# EAGLE design WhatCompressor (EAGLE 6.5.0)
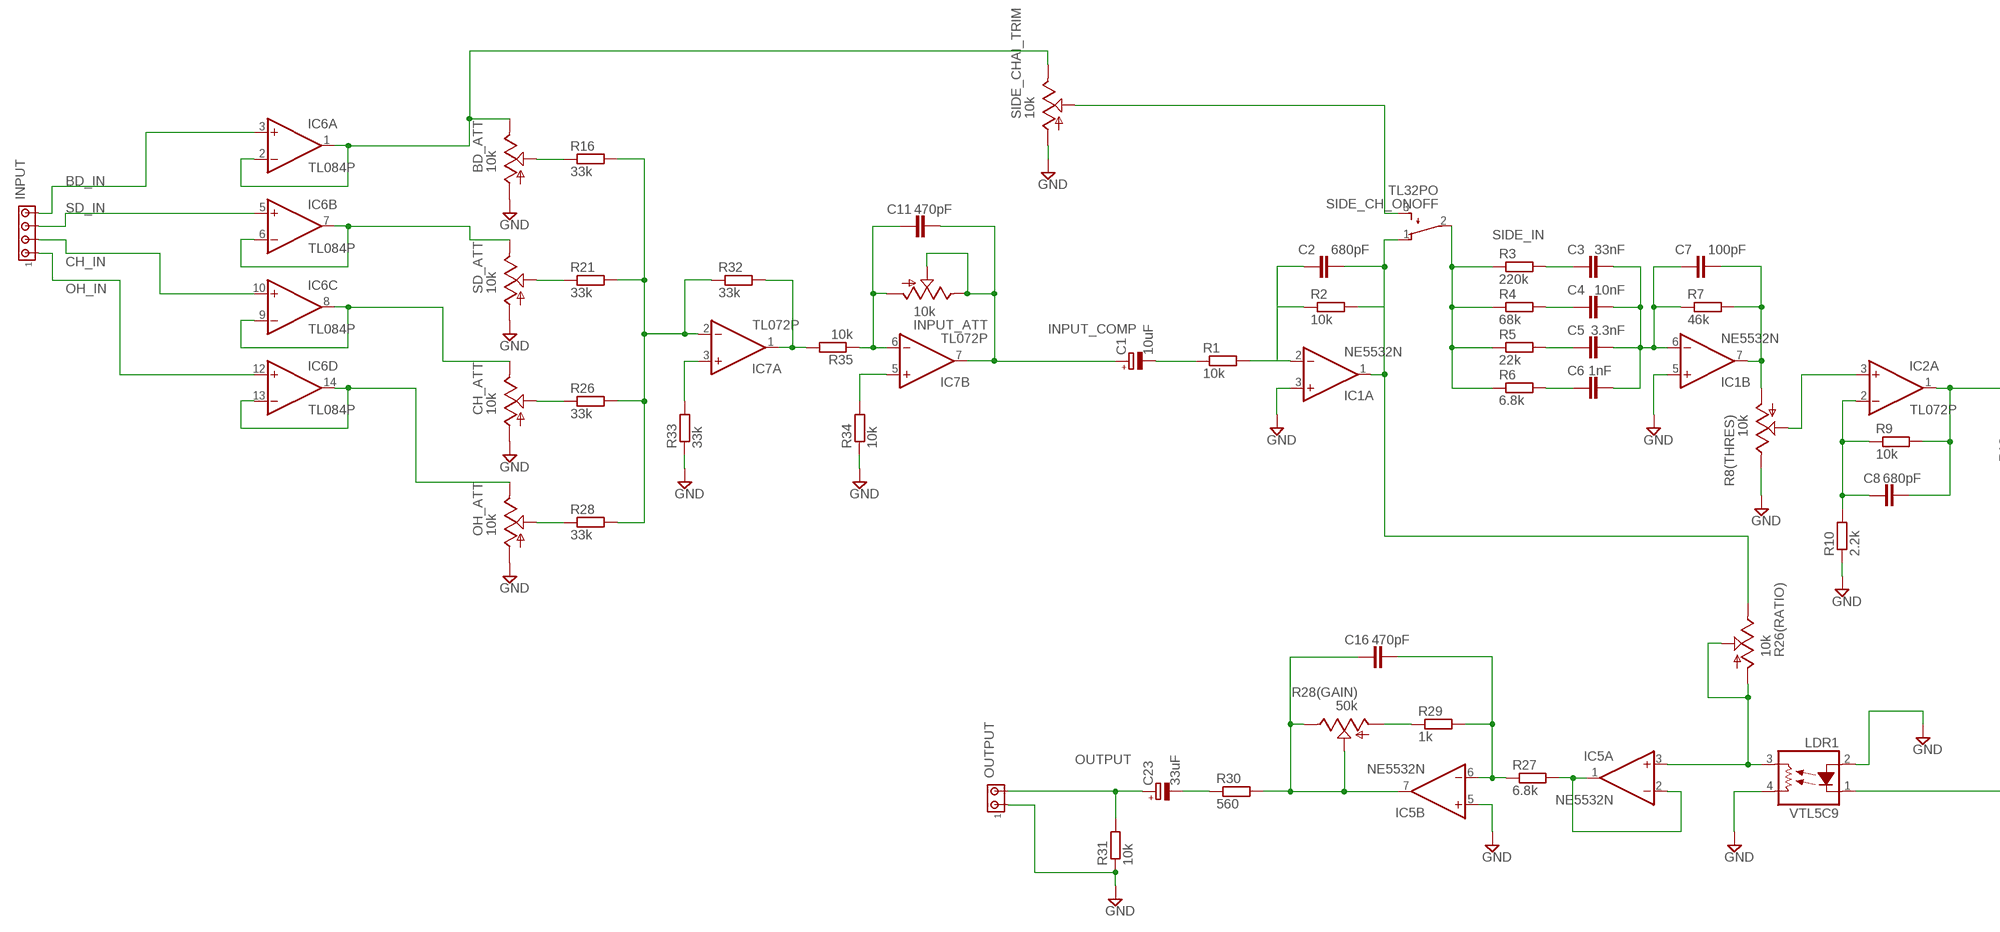
[diagram p0: schematic, sheet 1, part 1 of 2]
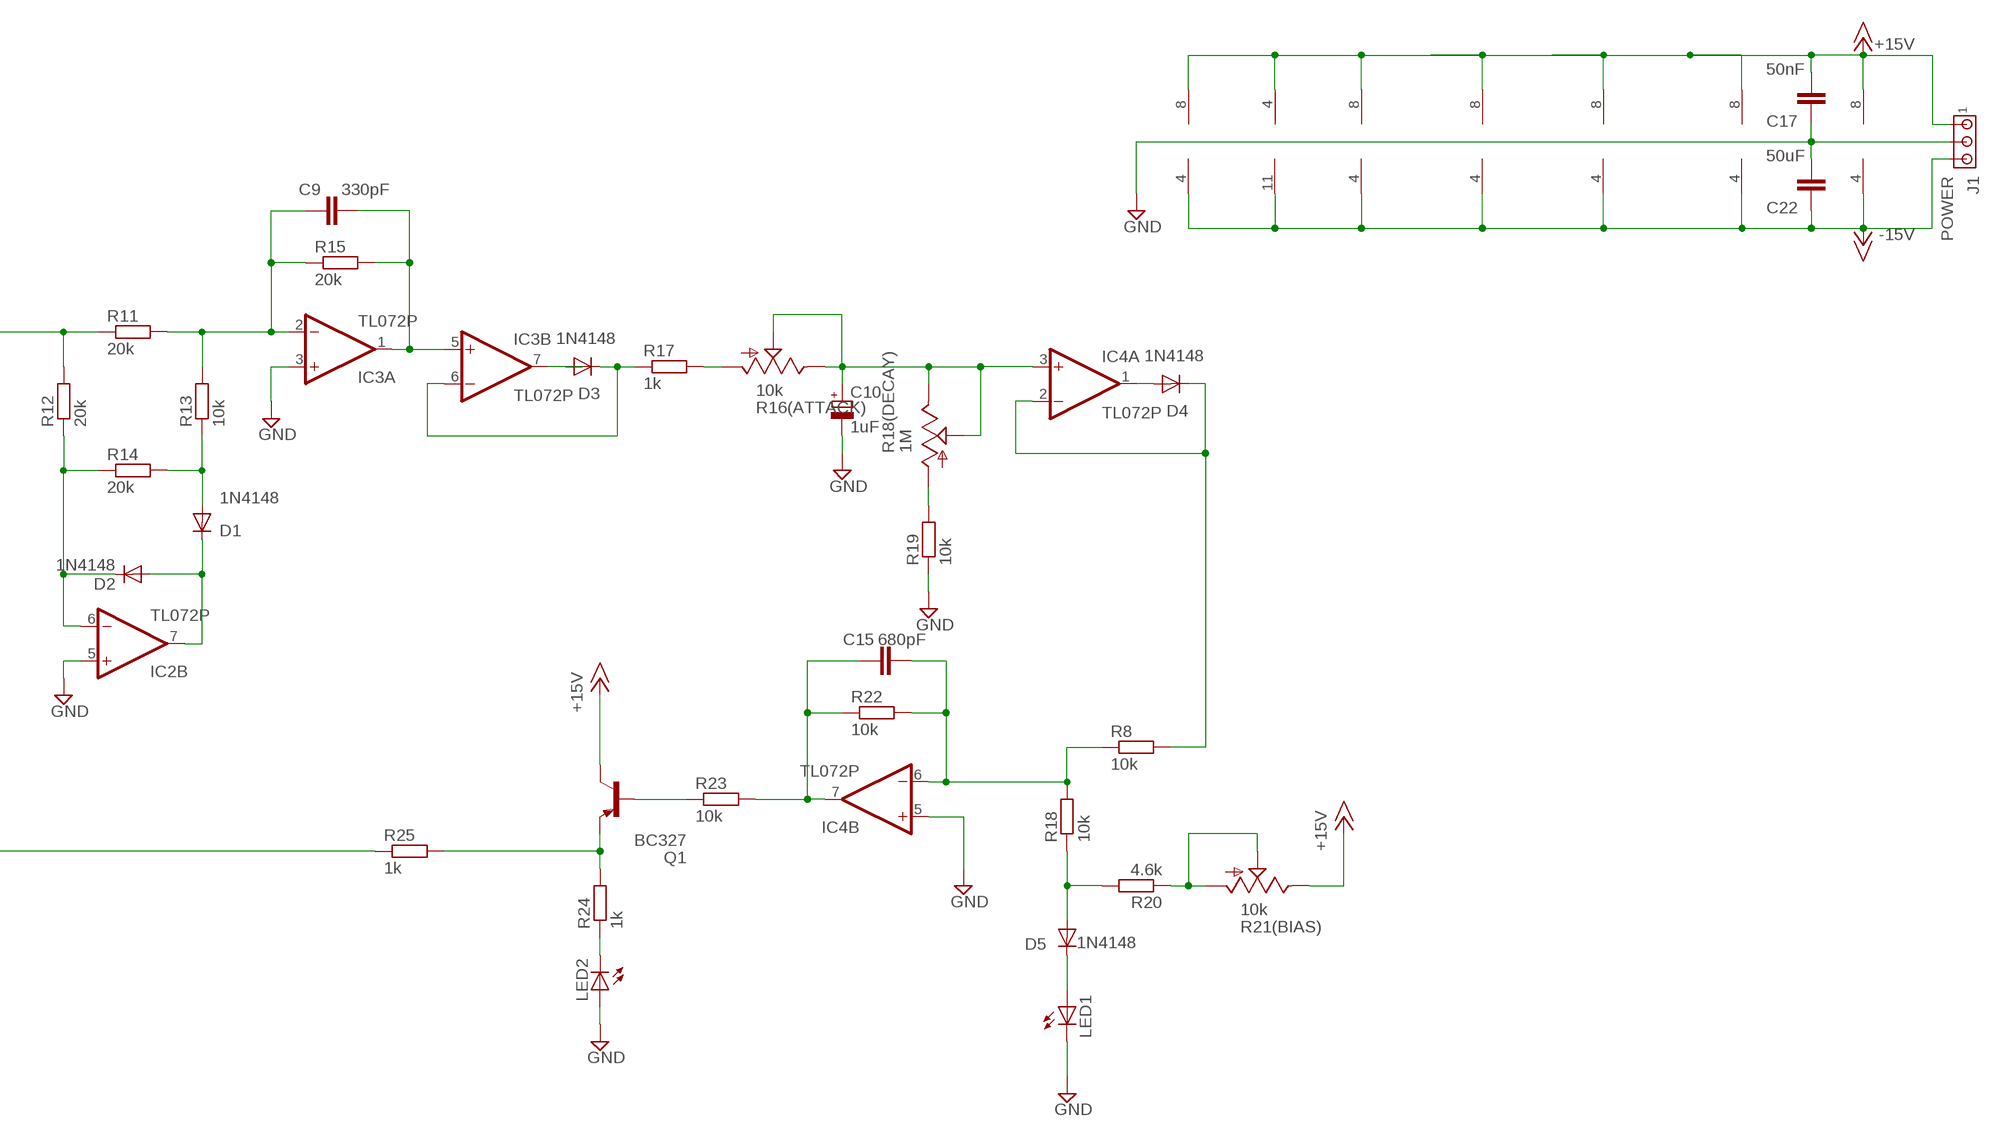
[diagram p1: schematic, sheet 1, part 2 of 2]

## Parts
BD_ATT  10k  TRIM_US-B64Y  [B64Y]
C1  10uF  CPOL-EUE2.5-5  [E2,5-5]
C2  680pF  C-EU050-024X044  [C050-024X044]
C3  33nF  C-EU050-024X044  [C050-024X044]
C4  10nF  C-EU050-024X044  [C050-024X044]
C5  3.3nF  C-EU050-024X044  [C050-024X044]
C6  1nF  C-EU050-024X044  [C050-024X044]
C7  100pF  C-EU050-024X044  [C050-024X044]
C8  680pF  C-EU050-024X044  [C050-024X044]
C9  330pF  C-EU050-024X044  [C050-024X044]
C10  1uF  CPOL-EUE2.5-5  [E2,5-5]
C11  470pF  C-EU050-024X044  [C050-024X044]
C15  680pF  C-EU050-024X044  [C050-024X044]
C16  470pF  C-EU050-024X044  [C050-024X044]
C17  50nF  C-EU050-024X044  [C050-024X044]
C22  50uF  C-EU050-024X044  [C050-024X044]
C23  33uF  CPOL-EUE2.5-5  [E2,5-5]
CH_ATT  10k  TRIM_US-B64Y  [B64Y]
D1  1N4148  1N4148DO35-7  [DO35-7]
D2  1N4148  1N4148DO35-7  [DO35-7]
D3  1N4148  1N4148DO35-7  [DO35-7]
D4  1N4148  1N4148DO35-7  [DO35-7]
D5  1N4148  1N4148DO35-7  [DO35-7]
IC1  NE5532N  [DIL08]
IC2  TL072P  [DIL08]
IC3  TL072P  [DIL08]
IC4  TL072P  [DIL08]
IC5  NE5532N  [DIL08]
IC6  TL084P  [DIL14]
IC7  TL072P  [DIL08]
INPUT  MTA04-100  [10X04MTA]
INPUT_ATT  10k  TRIM_US-B64Y  [B64Y]
J1  POWER  MTA03-100  [10X03MTA]
LDR1  VTL5C9  [VTL5C]
LED1  LED5MM  [LED5MM]
LED2  LED5MM  [LED5MM]
OH_ATT  10k  TRIM_US-B64Y  [B64Y]
OUTPUT  MTA02-100  [10X02MTA]
Q1  BC327  [TO92-EBC]
R1  10k  R-EU_0204/7  [0204/7]
R2  10k  R-EU_0204/7  [0204/7]
R3  220k  R-EU_0204/7  [0204/7]
R4  68k  R-EU_0204/7  [0204/7]
R5  22k  R-EU_0204/7  [0204/7]
R6  6.8k  R-EU_0204/7  [0204/7]
R7  46k  R-EU_0204/7  [0204/7]
R8  10k  R-EU_0204/7  [0204/7]
R8(THRES)  10k  TRIM_US-B64Y  [B64Y]
R9  10k  R-EU_0204/7  [0204/7]
R10  2.2k  R-EU_0204/7  [0204/7]
R11  20k  R-EU_0204/7  [0204/7]
R12  20k  R-EU_0204/7  [0204/7]
R13  10k  R-EU_0204/7  [0204/7]
R14  20k  R-EU_0204/7  [0204/7]
R15  20k  R-EU_0204/7  [0204/7]
R16  33k  R-EU_0204/7  [0204/7]
R16(ATTACK)  10k  TRIM_US-B64Y  [B64Y]
R17  1k  R-EU_0204/7  [0204/7]
R18  10k  R-EU_0204/7  [0204/7]
R18(DECAY)  1M  TRIM_US-B64Y  [B64Y]
R19  10k  R-EU_0204/7  [0204/7]
R20  4.6k  R-EU_0204/7  [0204/7]
R21  33k  R-EU_0204/7  [0204/7]
R21(BIAS)  10k  TRIM_US-B64Y  [B64Y]
R22  10k  R-EU_0204/7  [0204/7]
R23  10k  R-EU_0204/7  [0204/7]
R24  1k  R-EU_0204/7  [0204/7]
R25  1k  R-EU_0204/7  [0204/7]
R26  33k  R-EU_0204/7  [0204/7]
R26(RATIO)  10k  TRIM_US-B64Y  [B64Y]
R27  6.8k  R-EU_0204/7  [0204/7]
R28  33k  R-EU_0204/7  [0204/7]
R28(GAIN)  50k  TRIM_US-B64Y  [B64Y]
R29  1k  R-EU_0204/7  [0204/7]
R30  560  R-EU_0204/7  [0204/7]
R31  10k  R-EU_0204/7  [0204/7]
R32  33k  R-EU_0204/7  [0204/7]
R33  33k  R-EU_0204/7  [0204/7]
R34  10k  R-EU_0204/7  [0204/7]
R35  10k  R-EU_0204/7  [0204/7]
SD_ATT  10k  TRIM_US-B64Y  [B64Y]
SIDE_CH_ONOFF  TL32PO  [TL3XPO]
SIDE_CHAI_TRIM  10k  TRIM_US-B64Y  [B64Y]

## Nets
+15V: C17.2 IC1.8(P:V+) IC2.8(P:V+) IC3.8(P:V+) IC4.8(P:V+) IC5.8(P:V+) IC6.4(P:V+) IC7.8(P:V+) J1.1 Q1.C R21(BIAS).E
-15V: C22.1 IC1.4(P:V-) IC2.4(P:V-) IC3.4(P:V-) IC4.4(P:V-) IC5.4(P:V-) IC6.11(P:V-) IC7.4(P:V-) J1.3
BD_IN: IC6.3(A:+IN) INPUT.4
CH_IN: IC6.10(C:+IN) INPUT.2
GND: BD_ATT.A C10.- C17.1 C22.2 CH_ATT.A IC1.3(A:+IN) IC1.5(B:+IN) IC2.5(B:+IN) IC3.3(A:+IN) IC4.5(B:+IN) IC5.5(B:+IN) J1.2 LDR1.2(A) LDR1.4(L2) LED1.K(C) LED2.A OH_ATT.A OUTPUT.1 R8(THRES).E R10.1 R19.1 R31.1 R33.1 R34.1 SD_ATT.A SIDE_CHAI_TRIM.A
INPUT_COMP: C1.+ C11.2 IC7.7(B:OUT) INPUT_ATT.E INPUT_ATT.S
N$1: BD_ATT.E IC6.1(A:OUT) IC6.2(A:-IN) SIDE_CHAI_TRIM.E
N$2: C1.- R1.1
N$3: C2.1 IC1.2(A:-IN) R1.2 R2.1
N$4: IC6.6(B:-IN) IC6.7(B:OUT) SD_ATT.E
N$5: C3.1 R3.2
N$6: CH_ATT.E IC6.8(C:OUT) IC6.9(C:-IN)
N$7: C4.1 R4.2
N$8: C5.1 R5.2
N$9: C6.1 R6.2
N$10: C3.2 C4.2 C5.2 C6.2 C7.1 IC1.6(B:-IN) R7.1
N$11: C7.2 IC1.7(B:OUT) R7.2 R8(THRES).A
N$12: C8.1 IC2.2(A:-IN) R9.1 R10.2
N$13: C8.2 IC2.1(A:OUT) R9.2 R11.1 R12.2
N$14: IC2.3(A:+IN) R8(THRES).S
N$15: C9.1 IC3.2(A:-IN) R11.2 R13.2 R15.1
N$16: D2.C IC2.6(B:-IN) R12.1 R14.1
N$17: D1.A R13.1 R14.2
N$18: D1.C D2.A IC2.7(B:OUT)
N$19: C9.2 IC3.1(A:OUT) IC3.5(B:+IN) R15.2
N$20: D3.C IC3.6(B:-IN) R17.1
N$21: D3.A IC3.7(B:OUT)
N$22: D5.A R18.1 R20.2
N$23: R16(ATTACK).A R17.2
N$24: C10.+ IC4.3(A:+IN) R16(ATTACK).E R16(ATTACK).S R18(DECAY).E R18(DECAY).S
N$25: R18(DECAY).A R19.2
N$26: D4.C IC4.2(A:-IN) R8.2
N$27: D4.A IC4.1(A:OUT)
N$28: C15.2 IC4.6(B:-IN) R8.1 R18.2 R22.2
N$29: D5.C LED1.A
N$30: R20.1 R21(BIAS).A R21(BIAS).S
N$31: LED2.K(C) R24.1
N$32: C15.1 IC4.7(B:OUT) R22.1 R23.2
N$33: Q1.E R24.2 R25.2
N$34: Q1.B R23.1
N$35: LDR1.1(C) R25.1
N$36: IC5.3(A:+IN) LDR1.3(L1) R26(RATIO).A R26(RATIO).S
N$37: IC5.1(A:OUT) IC5.2(A:-IN) R27.2
N$38: C16.2 IC5.6(B:-IN) R27.1 R29.2
N$39: C23.- R30.1
N$40: R28(GAIN).A R29.1
N$41: C16.1 IC5.7(B:OUT) R28(GAIN).E R28(GAIN).S R30.2
N$43: SIDE_CH_ONOFF.3(S) SIDE_CHAI_TRIM.S
N$44: IC6.13(D:-IN) IC6.14(D:OUT) OH_ATT.E
N$46: BD_ATT.S R16.1
N$47: R21.1 SD_ATT.S
N$48: CH_ATT.S R26.1
N$49: OH_ATT.S R28.1
N$50: IC7.2(A:-IN) R16.2 R21.2 R26.2 R28.2 R32.1
N$51: IC7.3(A:+IN) R33.2
N$52: IC7.1(A:OUT) R32.2 R35.2
N$53: C11.1 IC7.6(B:-IN) INPUT_ATT.A R35.1
N$54: IC7.5(B:+IN) R34.2
OH_IN: IC6.12(D:+IN) INPUT.1
OUTPUT: C23.+ OUTPUT.2 R31.2
SD_IN: IC6.5(B:+IN) INPUT.3
SIDE_IN: R3.1 R4.1 R5.1 R6.1 SIDE_CH_ONOFF.2(P)
SIDE_OUT: C2.2 IC1.1(A:OUT) R2.2 R26(RATIO).E SIDE_CH_ONOFF.1(O)

## Library data of the parts
BD_ATT CH_ATT INPUT_ATT OH_ATT R8(THRES) R16(ATTACK) R18(DECAY) R21(BIAS) R26(RATIO) R28(GAIN) SD_ATT SIDE_CHAI_TRIM = pot:TRIM_US-: POTENTIOMETER; OC_FARNELL: unknown
C1 C23 = rcl:CPOL-EU: POLARIZED CAPACITOR, European symbol; MF: RUBYCON; MPN: 100PK10MEFC5X11; OC_FARNELL: 2346533
C2 C8 C15 = rcl:C-EU: CAPACITOR, European symbol; MF: VISHAY BC COMPONENTS; MPN: F681K33Y5RN6UK5R; OC_FARNELL: 1141791
C3 = rcl:C-EU: CAPACITOR, European symbol; MF: AVX; MPN: SR201C333KAR; OC_FARNELL: 1100438
C4 C17 C22 = rcl:C-EU: CAPACITOR, European symbol; MF: VISHAY; MPN: K103K15X7RF5TH5V; OC_FARNELL: 1902262
C5 C11 C16 = rcl:C-EU: CAPACITOR, European symbol; MF: MULTICOMP; MPN: MCBU7332K6; OC_FARNELL: 9411801
C6 = rcl:C-EU: CAPACITOR, European symbol; MF: VISHAY; MPN: K102K15X7RF5TH5V; OC_FARNELL: 1902259
C7 = rcl:C-EU: CAPACITOR, European symbol; MF: VISHAY BC COMPONENTS; MPN: F101K25Y5RP6UK5R; OC_FARNELL: 1141797
C9 = rcl:C-EU: CAPACITOR, European symbol; MF: VISHAY BC COMPONENTS; MPN: F331K29Y5RN6UK5R; OC_FARNELL: 1141787
C10 = rcl:CPOL-EU: POLARIZED CAPACITOR, European symbol; MF: PANASONIC; MPN: ECEA1HKS010; OC_FARNELL: 1902019
D1-D5 = diode:1N4148: DIODE high speed (Philips); MF: NXP; MPN: 1N4148; OC_FARNELL: 1081177
IC1 = linear:NE5532: AUDIO AMPLIFIER; MF: TEXAS INSTRUMENTS; MPN: NE5532P; OC_FARNELL: 1106092
IC2-IC4 = linear:TL072: OP AMP; MF: TEXAS INSTRUMENTS; MPN: TL072IP; OC_FARNELL: 1459704
IC5 = linear:NE5532: AUDIO AMPLIFIER
IC6 = linear:TL084: OP AMP
IC7 = linear:TL072: OP AMP
INPUT = con-amp:MTA04-100: AMP connector
J1 = con-amp:MTA03-100: AMP connector
LDR1 = optocoupler:VTL5C*: Low Cost Axial Vactrols Source: www.perkinelmer.com/opto ... vtl5c9_c10.pdf; MF: VACTEC PHOTO; MPN: VTL5C9; OC_FARNELL: 2067857; OC_NEWARK: 95F9033
LED1 LED2 = led:LED: LED OSRAM: - CHIPLED LG R971, LG N971, LY N971, LG Q971, LY Q971, LO R971, LY R971 LH N974, LH R974 LS Q976, LO Q976, LY Q976 LO Q996 - Hyper CHIPLED LW Q18S LB Q993, LB Q99A, LB R99A - SideLED LS A670, LO A670, LY A670, LG A670, LP A670 LB A673, LV A673, LT A673, LW A673 LH A674 LY A675 LS A676, LA A676, LO A676, LY A676, LW A676 LS A679, LY A679, LG A679 - Hyper Micro SIDELED® LS Y876, LA Y876, LO Y876, LY Y876 LT Y87S - SmartLED LW L88C, LW L88S LB L89C, LB L89S, LG L890 LS L89K, LO L89K, LY L89K LS L896, LA L896, LO L896, LY L896 - TOPLED LS T670, LO T670, LY T670, LG T670, LP T670 LSG T670, LSP T670, LSY T670, LOP T670, LYG T670 LG T671, LOG T671, LSG T671 LB T673, LV T673, LT T673, LW T673 LH T674 LS T676, LA T676, LO T676, LY T676, LB T676, LH T676, LSB T676, LW T676 LB T67C, LV T67C, LT T67C, LS T67K, LO T67K, LY T67K, LW E67C LS E67B, LA E67B, LO E67B, LY E67B, LB E67C, LV E67C, LT E67C LW T67C LS T679, LY T679, LG T679 LS T770, LO T770, LY T770, LG T770, LP T770 LB T773, LV T773, LT T773, LW T773 LH T774 LS E675, LA E675, LY E675, LS T675 LS T776, LA T776, LO T776, LY T776, LB T776 LHGB T686 LT T68C, LB T68C - Hyper Mini TOPLED® LB M676 - Mini TOPLED Santana® LG M470 LS M47K, LO M47K, LY M47K Source: http://www.osram.convergy.de LUXEON: - LUMILED® LXK2-PW12-R00, LXK2-PW12-S00, LXK2-PW14-U00, LXK2-PW14-V00 LXK2-PM12-R00, LXK2-PM12-S00, LXK2-PM14-U00 LXK2-PE12-Q00, LXK2-PE12-R00, LXK2-PE12-S00, LXK2-PE14-T00, LXK2-PE14-U00 LXK2-PB12-K00, LXK2-PB12-L00, LXK2-PB12-M00, LXK2-PB14-N00, LXK2-PB14-P00, LXK2-PB14-Q00 LXK2-PR12-L00, LXK2-PR12-M00, LXK2-PR14-Q00, LXK2-PR14-R00 LXK2-PD12-Q00, LXK2-PD12-R00, LXK2-PD12-S00 LXK2-PH12-R00, LXK2-PH12-S00 LXK2-PL12-P00, LXK2-PL12-Q00, LXK2-PL12-R00 Source: www.luxeon.com KINGBRIGHT: KA-3528ASYC Source: www.kingbright.com
OUTPUT = con-amp:MTA02-100: AMP connector
Q1 = transistor-pnp:BC327*: PNP Transistror
R1 R2 R9 R13 R19 R30 R31 = rcl:R-EU_: RESISTOR, European symbol; MF: MULTICOMP; MPN: MCCFR0W4J0103A50; OC_FARNELL: 1692465
R3 R16 R21 R26 R28 R32-R35 = rcl:R-EU_: RESISTOR, European symbol; MF: TE CONNECTIVITY; MPN: CFR16J220K; OC_FARNELL: 2329498
R4 = rcl:R-EU_: RESISTOR, European symbol; MF: TE CONNECTIVITY; MPN: CFR16J68K; OC_FARNELL: 2329546
R5 = rcl:R-EU_: RESISTOR, European symbol; MF: TE CONNECTIVITY; MPN: CFR16J22K; OC_FARNELL: 2329501
R6 R27 R29 = rcl:R-EU_: RESISTOR, European symbol; MF: MULTICOMP; MPN: MF25 6K8; OC_FARNELL: 9342168
R7 = rcl:R-EU_: RESISTOR, European symbol; MF: TE CONNECTIVITY; MPN: CFR16J47K; OC_FARNELL: 2329532
R8 R17 R18 R20 = rcl:R-EU_: RESISTOR, European symbol; MF: MULTICOMP; MPN: MCF 0.25W 1K; OC_FARNELL: 9339051
R10 = rcl:R-EU_: RESISTOR, European symbol; MF: MULTICOMP; MPN: MF25 2K2; OC_FARNELL: 9341536
R11 R12 R14 R15 R22-R25 = rcl:R-EU_: RESISTOR, European symbol; MF: TE CONNECTIVITY; MPN: LR0204F20K; OC_FARNELL: 2329897
SIDE_CH_ONOFF = switch:TL32PO: TINY SWITCH ON - MOM Source: http://www2.produktinfo.conrad.com/datenblaetter/700000-724999/705152-da-01-de-Subminiaturschalter_TL_36YO.pdf

## Board
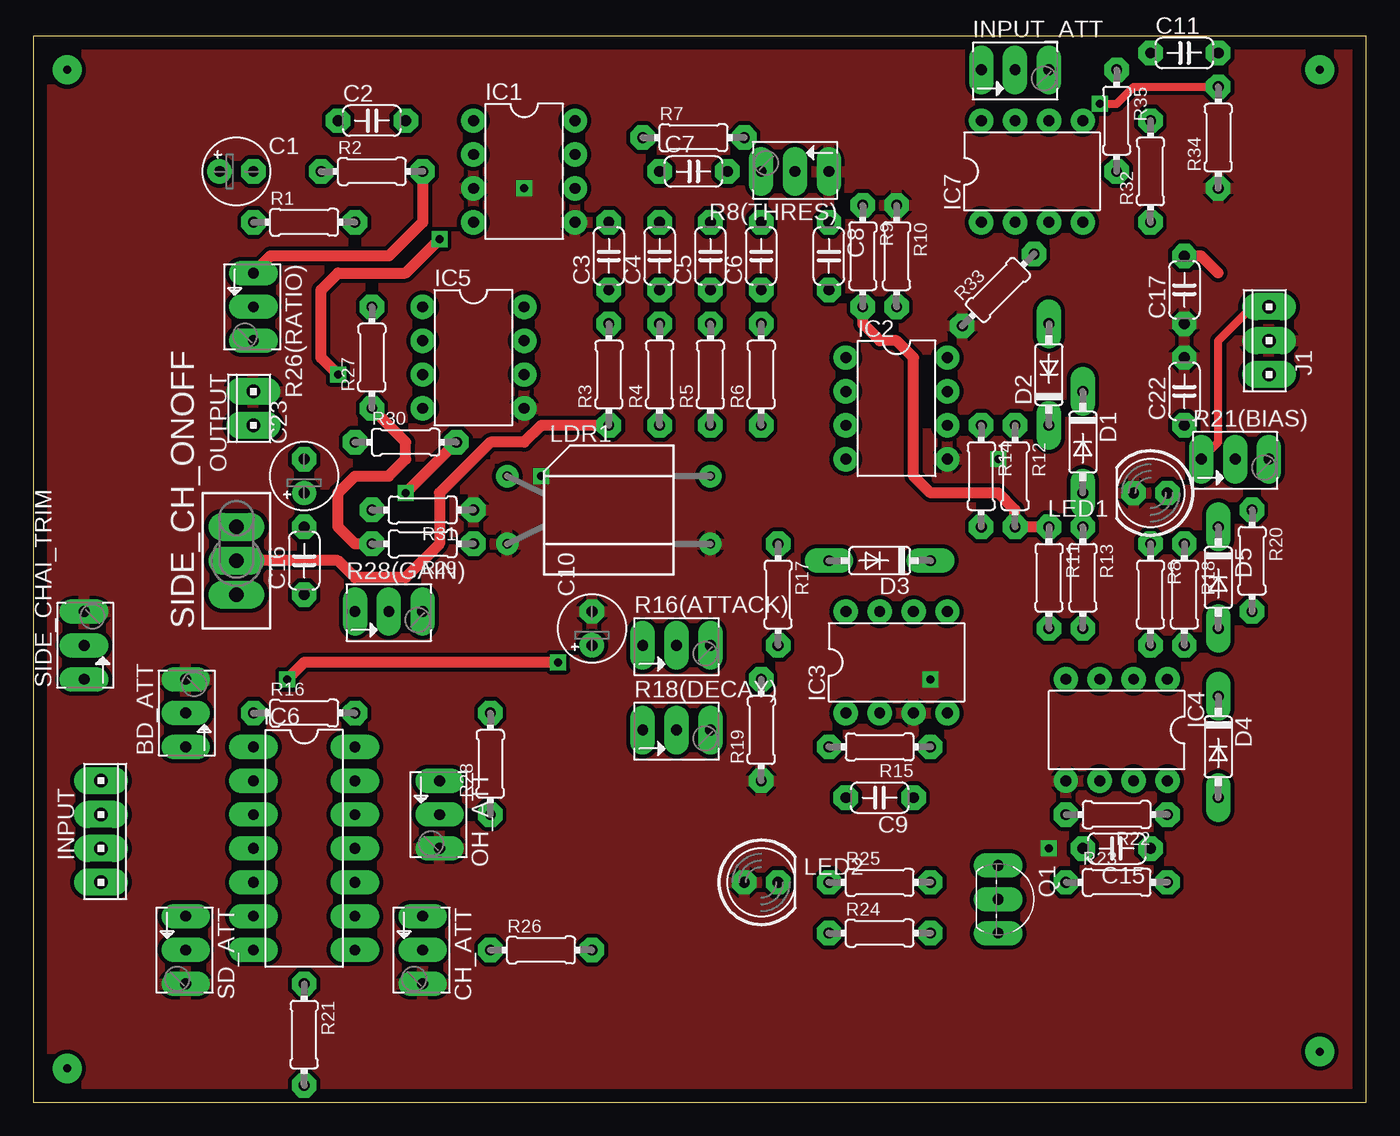
[diagram p2: board, top side]
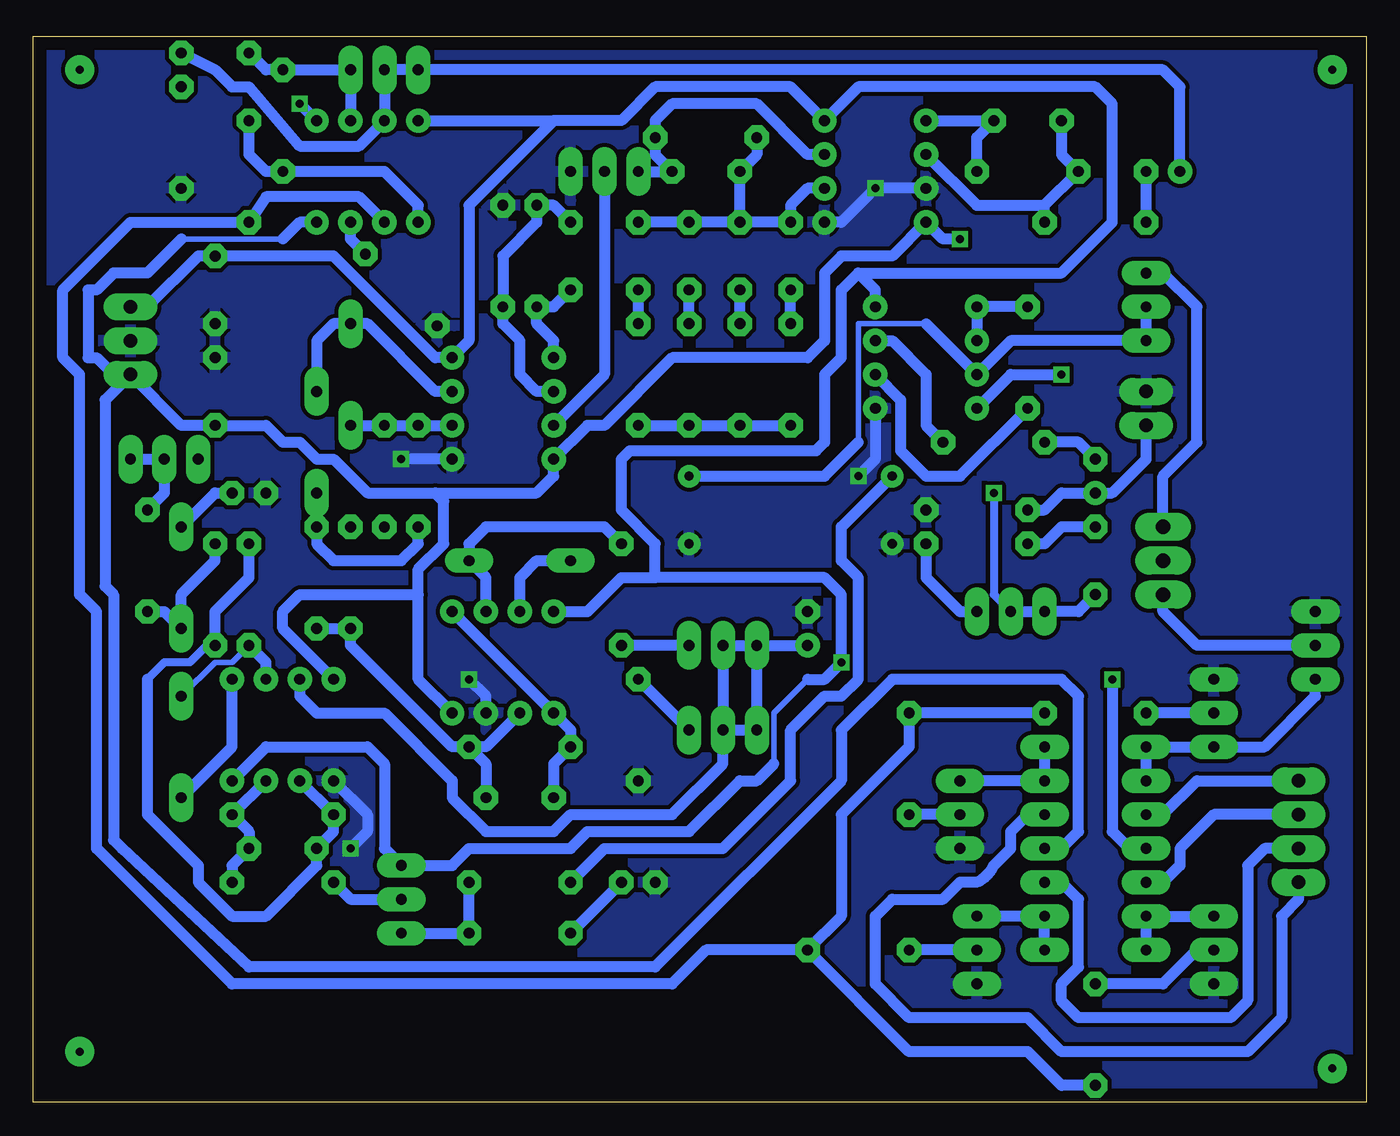
[diagram p3: board, bottom side, seen from below]

Size 100 x 80 mm. Coordinates in mm from the lower left corner, seen from the top.
Outline: 0,0 100,0 100,80 0,80 0,0
Copper layers (1*16): Top 0.035mm / dielectric 1.5mm / Bottom 0.035mm
Design rules "default *": minimum track width 10mil, minimum drill 24mil, track to track 8mil, track to pad 8mil, pad to pad 8mil, via to via 8mil, smd to smd 8mil, copper to edge 40mil, drill to drill 8mil, minimum pad ring 10mil, minimum via ring 8mil, stop-mask expansion 4mil, vias tented up to drill 0mil, thermal gap 10mil

### Footprints (pad centres in the part's own frame; a part is rotated, then mirrored left to right if it is on the bottom)
B64Y = drill 0.813 long: A 2.54,0; E -2.54,0; S 0,0
E2,5-5 = drill 0.813 pad 1.6: + -1.27,0 | drill 0.813 pad 1.6 octagon: - 1.27,0
C050-024X044 = drill 0.813 octagon: 1 -2.54,0; 2 2.54,0
DO35-7 = drill 0.813 long: A 3.81,0; C -3.81,0
DIL08 = drill 0.813 pad 1.27: 1 -3.81,-3.81; 2 -1.27,-3.81; 3 1.27,-3.81; 4 3.81,-3.81; 5 3.81,3.81; 6 1.27,3.81; 7 -1.27,3.81; 8 -3.81,3.81
DIL14 = drill 0.813 long: 1 -7.62,-3.81; 2 -5.08,-3.81; 3 -2.54,-3.81; 4 0,-3.81; 5 2.54,-3.81; 6 5.08,-3.81; 7 7.62,-3.81; 8 7.62,3.81; 9 5.08,3.81; 10 2.54,3.81; 11 0,3.81; 12 -2.54,3.81; 13 -5.08,3.81; 14 -7.62,3.81
10X04MTA = drill 1.016 long: 1 3.81,0; 2 1.27,0; 3 -1.27,0; 4 -3.81,0
10X03MTA = drill 1.016 long: 1 2.54,0; 2 0,0; 3 -2.54,0
VTL5C = drill 0.7 pad 1.3: 1 -7.62,2.54; 2 -7.62,-2.54; 3 7.62,2.54; 4 7.62,-2.54
LED5MM = drill 0.813 octagon: A -1.27,0; K 1.27,0
10X02MTA = drill 1.016 long: 1 1.27,0; 2 -1.27,0
TO92-EBC = drill 0.813 long: B 0,-1.27; C -2.54,-1.27; E 2.54,-1.27
0204/7 = drill 0.813 octagon: 1 -3.81,0; 2 3.81,0
TL3XPO = drill 1.1 pad 1.422 long: 1 -2.54,0; 2 0,0; 3 2.54,0

### Placement (x,y rotation side)
BD_ATT  11.43,29.21 90 top
C1  15.24,69.85 0 top
C2  25.4,73.66 0 top
C3  43.18,63.5 90 top
C4  46.99,63.5 90 top
C5  50.8,63.5 90 top
C6  54.61,63.5 90 top
C7  49.53,69.85 0 top
C8  59.69,63.5 270 top
C9  63.5,22.86 180 top
C10  41.91,35.56 90 top
C11  86.36,78.74 0 top
C15  81.28,19.05 180 top
C16  20.32,40.64 90 top
C17  86.36,60.96 90 top
C22  86.36,53.34 90 top
C23  20.32,46.99 90 top
CH_ATT  29.21,11.43 270 top
D1  78.74,49.53 270 top
D2  76.2,54.61 90 top
D3  63.5,40.64 180 top
D4  88.9,26.67 270 top
D5  88.9,39.37 270 top
IC1  36.83,69.85 270 top
IC2  64.77,52.07 270 top
IC3  64.77,33.02 0 top
IC4  81.28,27.94 180 top
IC5  33.02,55.88 270 top
IC6  20.32,19.05 270 top
IC7  74.93,69.85 0 top
INPUT  5.08,20.32 270 top
INPUT_ATT  73.66,77.47 0 top
J1  92.71,57.15 90 top
LDR1  43.18,44.45 0 top
LED1  83.82,45.72 180 top
LED2  54.61,16.51 0 top
OH_ATT  30.48,21.59 270 top
OUTPUT  16.51,52.07 90 top
Q1  73.66,15.24 270 top
R1  20.32,66.04 0 top
R2  25.4,69.85 0 top
R3  43.18,54.61 90 top
R4  46.99,54.61 90 top
R5  50.8,54.61 90 top
R6  54.61,54.61 90 top
R7  49.53,72.39 0 top
R8  83.82,38.1 270 top
R8(THRES)  57.15,69.85 180 top
R9  62.23,63.5 270 top
R10  64.77,63.5 270 top
R11  76.2,39.37 270 top
R12  73.66,46.99 270 top
R13  78.74,39.37 270 top
R14  71.12,46.99 270 top
R15  63.5,26.67 180 top
R16  20.32,29.21 0 top
R16(ATTACK)  48.26,34.29 0 top
R17  55.88,38.1 270 top
R18  86.36,38.1 270 top
R18(DECAY)  48.26,27.94 0 top
R19  54.61,27.94 90 top
R20  91.44,40.64 270 top
R21  20.32,5.08 270 top
R21(BIAS)  90.17,48.26 0 top
R22  81.28,21.59 180 top
R23  81.28,16.51 0 top
R24  63.5,12.7 0 top
R25  63.5,16.51 0 top
R26  38.1,11.43 0 top
R26(RATIO)  16.51,59.69 270 top
R27  25.4,55.88 90 top
R28  34.29,25.4 90 top
R28(GAIN)  26.67,36.83 0 top
R29  29.21,41.91 180 top
R30  27.94,49.53 0 top
R31  29.21,44.45 180 top
R32  83.82,69.85 90 top
R33  72.39,60.96 45 top
R34  88.9,72.39 90 top
R35  81.28,73.66 270 top
SD_ATT  11.43,11.43 270 top
SIDE_CH_ONOFF  15.24,40.64 270 top
SIDE_CHAI_TRIM  3.81,34.29 90 top

### Tracks (layer width: path | path; a pad name or v marks a point on that pad's centre or on a via)
+15V  (via drill 0.6 pad 1.02)
  Top 0.61: R21(BIAS).E 88.9,49.53 88.9,57.15 91.44,59.69
  Top 0.813: 88.9,62.23 87.63,63.5 C17.2 | v39.37,33.02 20.32,33.02 v19.05,31.75 | 91.44,59.69 J1.1
  Bottom 0.406: 44.45,25.4 44.45,29.21 41.91,31.75
  Bottom 0.813: J1.1 91.44,59.69 87.63,63.5 C17.2 77.47,63.5 69.85,55.88 IC2.8 67.31,57.15 67.31,67.31 60.96,73.66 | 60.96,73.66 55.88,73.66 53.34,76.2 43.18,76.2 IC1.8 38.1,76.2 20.32,76.2 19.05,74.93 19.05,66.04 22.86,62.23 38.1,62.23 | IC4.8 82.55,26.67 74.93,26.67 73.66,25.4 73.66,19.05 Q1.C 68.58,17.78 67.31,19.05 59.69,19.05 58.42,20.32 50.8,20.32 46.99,24.13 45.72,24.13 44.45,25.4 | 41.91,31.75 40.64,31.75 v39.37,33.02 39.37,38.1 40.64,39.37 53.34,39.37 | IC3.8 58.42,36.83 55.88,39.37 53.34,39.37 | 53.34,39.37 53.34,41.91 55.88,44.45 55.88,48.26 55.24,48.89 41.27,48.89 40.64,49.53 40.64,54.61 39.37,55.88 39.37,60.96 38.1,62.23 | IC5.8 36.83,60.96 38.1,62.23 | v19.05,31.75 19.05,20.32 17.78,19.05 IC6.4 | IC7.8 60.96,73.66
-15V  (via drill 0.6 pad 1.02)
  Top 0.813: v22.86,54.61 21.59,55.88 21.59,60.96 22.86,62.23 27.94,62.23 v30.48,64.77
  Bottom 0.406: 81.28,64.77 88.9,64.77
  Bottom 0.813: J1.3 88.9,50.8 C22.1 82.55,50.8 81.28,49.53 80.01,49.53 78.74,48.26 77.47,48.26 74.93,45.72 69.85,45.72 | 69.85,45.72 62.23,45.72 60.96,46.99 IC2.4 58.42,50.8 57.15,50.8 52.07,55.88 41.91,55.88 40.64,57.15 40.64,62.23 39.37,63.5 35.56,63.5 IC1.4 31.75,64.77 v30.48,64.77 | IC3.4 71.12,31.75 71.12,38.1 | 71.12,38.1 71.12,40 69.22,41.91 69.22,45.08 69.85,45.72 | IC4.4 81.28,35.56 81.28,36.83 80.01,38.1 71.12,38.1 | IC5.4 26.67,54.61 v22.86,54.61 | IC6.11 22.86,19.05 21.59,20.32 21.59,30.48 22.86,31.75 35.56,31.75 39.37,27.94 39.37,24.13 53.34,10.16 83.82,10.16 93.34,19.05 93.98,19.68 93.98,38.1 94.62,38.73 94.62,52.7 J1.3 | IC7.4 80.01,66.04 81.28,64.77 | 88.9,64.77 91.44,62.23 93.98,62.23 95.25,60.96 95.89,60.96 95.89,55.88 95.25,55.88 93.98,54.61 J1.3
BD_IN
  Bottom 0.813: IC6.3 15.24,21.59 12.7,24.13 INPUT.4
CH_IN
  Bottom 0.813: INPUT.2 7.62,19.05 8.89,17.78 8.89,7.62 10.16,6.35 21.59,6.35 22.86,7.62 22.86,8.89 21.59,10.16 21.59,15.24 22.86,16.51 IC6.10
GND  (via drill 0.6 pad 1.02)
  Bottom 0.813: IC1.3 v36.83,68.58 39.37,66.04 IC1.5 | IC2.5 v72.39,48.26 | IC3.3 66.04,30.48 v67.31,31.75 | IC4.5 74.93,21.59 74.93,20.32 v76.2,19.05 | IC5.5 36.83,48.26 v38.1,46.99
  pour Top (isolate 0.305): 0,80.01 100.33,80.01 100.33,0 0,0
  pour Bottom (isolate 0.305): 0,80.01 100.33,80.01 100.33,0 0,0
INPUT_COMP
  Bottom 0.813: C1.+ 13.97,76.2 15.24,77.47 INPUT_ATT.E INPUT_ATT.S IC7.7 75.56,71.76 80.01,71.76 83.82,76.2 85.09,76.2 86.36,77.47 C11.2
N$1
  Bottom 0.813: IC6.2 IC6.1 BD_ATT.E 7.62,26.67 3.81,30.48 SIDE_CHAI_TRIM.E
N$2
  Bottom 0.813: R1.1 C1.-
N$3
  Bottom 0.813: R1.2 24.13,67.31 | 24.13,67.31 R2.1 22.86,71.12 C2.1 | IC1.2 29.21,67.31 24.13,67.31
N$4
  Bottom 0.813: IC6.7 IC6.6 SD_ATT.E
N$5
  Bottom 0.813: R3.2 C3.1
N$6
  Bottom 0.813: IC6.8 IC6.9 CH_ATT.E
N$7
  Bottom 0.813: R4.2 C4.1
N$8
  Bottom 0.813: R5.2 C5.1
N$9
  Bottom 0.813: R6.2 C6.1
N$10
  Bottom 0.813: R7.1 45.72,71.12 C7.1 C4.2 | C4.2 C3.2 43.18,67.31 41.91,68.58 IC1.6 | C4.2 C5.2 C6.2
N$11
  Bottom 0.813: IC1.7 41.91,71.12 45.72,74.93 52.07,74.93 53.34,73.66 R7.2 53.34,71.12 C7.2 R8(THRES).A
N$12
  Bottom 0.813: IC2.2 62.23,53.34 63.5,54.61 63.5,57.15 64.77,58.42 R10.2 64.77,63.5 62.23,66.04 R9.1 60.96,67.31 C8.1
N$13
  Top 0.813: R11.1 R12.2 73.66,44.45 72.39,45.72 67.31,45.72 66.04,46.99 66.04,55.88 64.77,57.15 63.5,57.15 62.23,58.42 R9.2
  Bottom 0.813: IC2.1 60.96,57.15 62.23,58.42 R9.2 60.96,59.69 C8.2
N$14
  Bottom 0.813: R8(THRES).S 57.15,54.61 IC2.3
N$15
  Bottom 0.813: R13.2 R11.2 76.2,34.29 68.58,26.67 R15.1 | IC3.2 66.04,26.67 R15.1 | R15.1 66.04,25.4 C9.1
N$16
  Bottom 0.813: D2.C R12.1 R14.1 IC2.6
N$17
  Bottom 0.813: D1.A R13.1 78.74,41.91 77.47,40.64 72.39,40.64 71.12,41.91 R14.2
N$18
  Bottom 0.813: IC2.7 69.85,53.34 74.93,58.42 D2.A 77.47,58.42 78.74,57.15 D1.C
N$19
  Bottom 0.813: IC3.5 IC3.1 59.69,27.94 R15.2 60.96,25.4 C9.2
N$20
  Bottom 0.813: IC3.6 66.04,39.37 D3.C 67.31,41.91 66.04,43.18 57.15,43.18 R17.1
N$21
  Bottom 0.813: IC3.7 63.5,39.37 62.23,40.64 D3.A
N$22
  Bottom 0.813: R20.2 90.17,36.83 D5.A 88.9,38.1 86.36,40.64 R18.1
N$23
  Bottom 0.813: R16(ATTACK).A R17.2
N$24
  Bottom 0.813: R18(DECAY).S R18(DECAY).E R16(ATTACK).E | R18(DECAY).S R16(ATTACK).S R16(ATTACK).E | R16(ATTACK).E C10.+ | IC4.3 80.01,30.48 78.74,29.21 73.66,29.21 68.58,24.13 68.58,22.86 66.04,20.32 60.96,20.32 59.69,21.59 52.07,21.59 48.26,25.4 R18(DECAY).S
N$25
  Bottom 0.813: R18(DECAY).A R19.2
N$26
  Bottom 0.406: D4.C 86.36,33.02 85.09,33.02 R8.2
  Bottom 0.813: IC4.2 82.55,33.02 R8.2
N$27
  Bottom 0.813: D4.A 85.09,26.67 IC4.1
N$28
  Bottom 0.61: R18.2 87,34.29 88.27,33.02 90.17,33.02 91.44,31.75
  Bottom 0.813: IC4.6 R22.2 77.47,20.32 C15.2 78.74,17.78 82.55,13.97 85.09,13.97 87.63,16.51 87.63,17.78 91.44,21.59 91.44,31.75 | R18.2 86.36,36.83 83.82,39.37 R8.1
N$29
  Bottom 0.813: D5.C 86.36,45.72 LED1.A
N$30
  Bottom 0.813: R21(BIAS).A R21(BIAS).S 90.17,45.72 R20.1
N$31
  Bottom 0.813: R24.1 LED2.K
N$32
  Bottom 0.813: IC4.7 R22.1 83.82,20.32 C15.1 85.09,17.78 R23.2
N$33
  Bottom 0.813: Q1.E R24.2 R25.2
N$34
  Bottom 0.813: R23.1 76.2,15.24 Q1.B
N$35
  Bottom 0.813: R25.1 57.15,19.05 48.26,19.05 43.18,24.13 43.18,27.94 40.64,30.48 39.37,30.48 38.1,31.75 38.1,39.37 39.37,40.64 39.37,43.18 LDR1.1
N$36
  Bottom 0.406: 38.1,49.53 38.1,58.42 33.02,58.42
  Bottom 0.813: R26(RATIO).S R26(RATIO).A 26.67,57.15 IC5.3 33.02,58.42 | LDR1.3 40.64,46.99 38.1,49.53
N$37
  Bottom 0.813: IC5.2 IC5.1 R27.2
N$38
  Top 0.813: R29.2 24.13,41.91 22.86,43.18 22.86,45.72 24.13,46.99 26.67,46.99 27.94,48.26 27.94,49.53 R27.1
  Bottom 0.813: IC5.6 34.92,52.7 34.92,48.89 33.02,46.99 30.48,46.99 R27.1 | C16.2 22.86,43.18 24.13,41.91 R29.2
N$39
  Bottom 0.813: C23.- 21.59,49.53 R30.1
N$40
  Bottom 0.813: R29.1 33.02,39.37 30.48,36.83 R28(GAIN).A
N$41  (via drill 0.6 pad 1.02)
  Top 0.813: v27.94,45.72 R30.2
  Bottom 0.61: v27.94,45.72 27.94,38.1 R28(GAIN).S
  Bottom 0.813: IC5.7 35.56,57.15 33.02,54.61 33.02,50.8 R30.2 | R28(GAIN).S R28(GAIN).E 21.59,36.83 C16.1
N$42  (via drill 0.6 pad 2.18)
  other vias: 2.54,77.47
N$43
  Bottom 0.813: SIDE_CHAI_TRIM.S 12.7,34.29 15.24,36.83 SIDE_CH_ONOFF.3
N$44
  Bottom 0.813: IC6.14 IC6.13 OH_ATT.E
N$45  (via drill 0.6 pad 2.18)
  other vias: 96.52,3.81
N$46
  Bottom 0.813: BD_ATT.S R16.1
N$47
  Bottom 0.813: SD_ATT.S 12.7,11.43 15.24,8.89 R21.1
N$48
  Bottom 0.813: CH_ATT.S R26.1
N$49
  Bottom 0.813: OH_ATT.S R28.1
N$50
  Bottom 0.813: R16.2 R28.2 34.29,26.67 39.37,21.59 39.37,13.97 R26.2 | R21.2 22.86,1.27 25.4,3.81 34.29,3.81 R26.2 | IC7.2 75.56,67.95 82.55,67.95 R32.1 92.71,66.04 97.79,60.96 97.79,55.88 96.52,54.61 96.52,38.1 95.25,36.83 95.25,19.05 85.09,8.89 52.07,8.89 49.53,11.43 R26.2
N$51
  Bottom 0.813: R33.2 76.2,64.77 IC7.3
N$52
  Bottom 0.813: IC7.1 71.12,67.31 73.66,69.85 R35.2 82.55,69.85 83.82,71.12 R32.2
N$53
  Bottom 0.813: IC7.6 INPUT_ATT.A R35.1 82.55,77.47 C11.1
N$54  (via drill 0.6 pad 1.02)
  Top 0.61: v80.01,74.93 81.28,74.93 82.55,76.2 R34.2
  Bottom 0.813: IC7.5 v80.01,74.93
N$55  (via drill 0.6 pad 2.18)
  other vias: 2.54,2.54
N$56  (via drill 0.6 pad 2.18)
  other vias: 96.52,77.47
OH_IN
  Bottom 0.813: INPUT.1 5.08,15.24 6.35,13.97 6.35,6.35 8.89,3.81 22.86,3.81 25.4,6.35 34.29,6.35 36.83,8.89 36.83,13.97 35.56,15.24 31.75,15.24 30.48,16.51 29.21,16.51 arc-39 27.94,17.78 26.67,19.05 26.67,20.32 25.4,21.59 IC6.12
OUTPUT
  Bottom 0.813: R31.2 24.13,44.45 22.86,45.72 C23.+ 19.05,45.72 16.51,48.26 OUTPUT.2
SD_IN
  Bottom 0.813: INPUT.3 11.43,21.59 13.97,19.05 13.97,17.78 15.24,16.51 IC6.5
SIDE_IN
  Top 0.813: R3.1 38.1,50.8 36.83,49.53 34.29,49.53 30.48,45.72 30.48,41.91 27.94,39.37 24.13,39.37 22.86,40.64 SIDE_CH_ONOFF.2
  Bottom 0.813: R6.1 R5.1 R4.1 R3.1
SIDE_OUT
  Top 0.813: R2.2 29.21,66.04 26.67,63.5 17.78,63.5 R26(RATIO).E
  Bottom 0.813: IC1.1 C2.2 29.21,72.39 R2.2 | SIDE_CH_ONOFF.1 15.24,46.99 12.7,49.53 12.7,59.69 15.24,62.23 R26(RATIO).E